# Altium schematic sheet AC-DC.SchDoc
size 420 x 297 mm; Address1: Address1; Address2: Address2; Address3: Address3; Address4: Address4; DocumentNumber: АБВГ.123456.001 Э3; SheetNumber: 2; Scale: 1:1; DocumentType: Схема электрическая принципиальная; FirstReferrence: АБВГ.123456.001
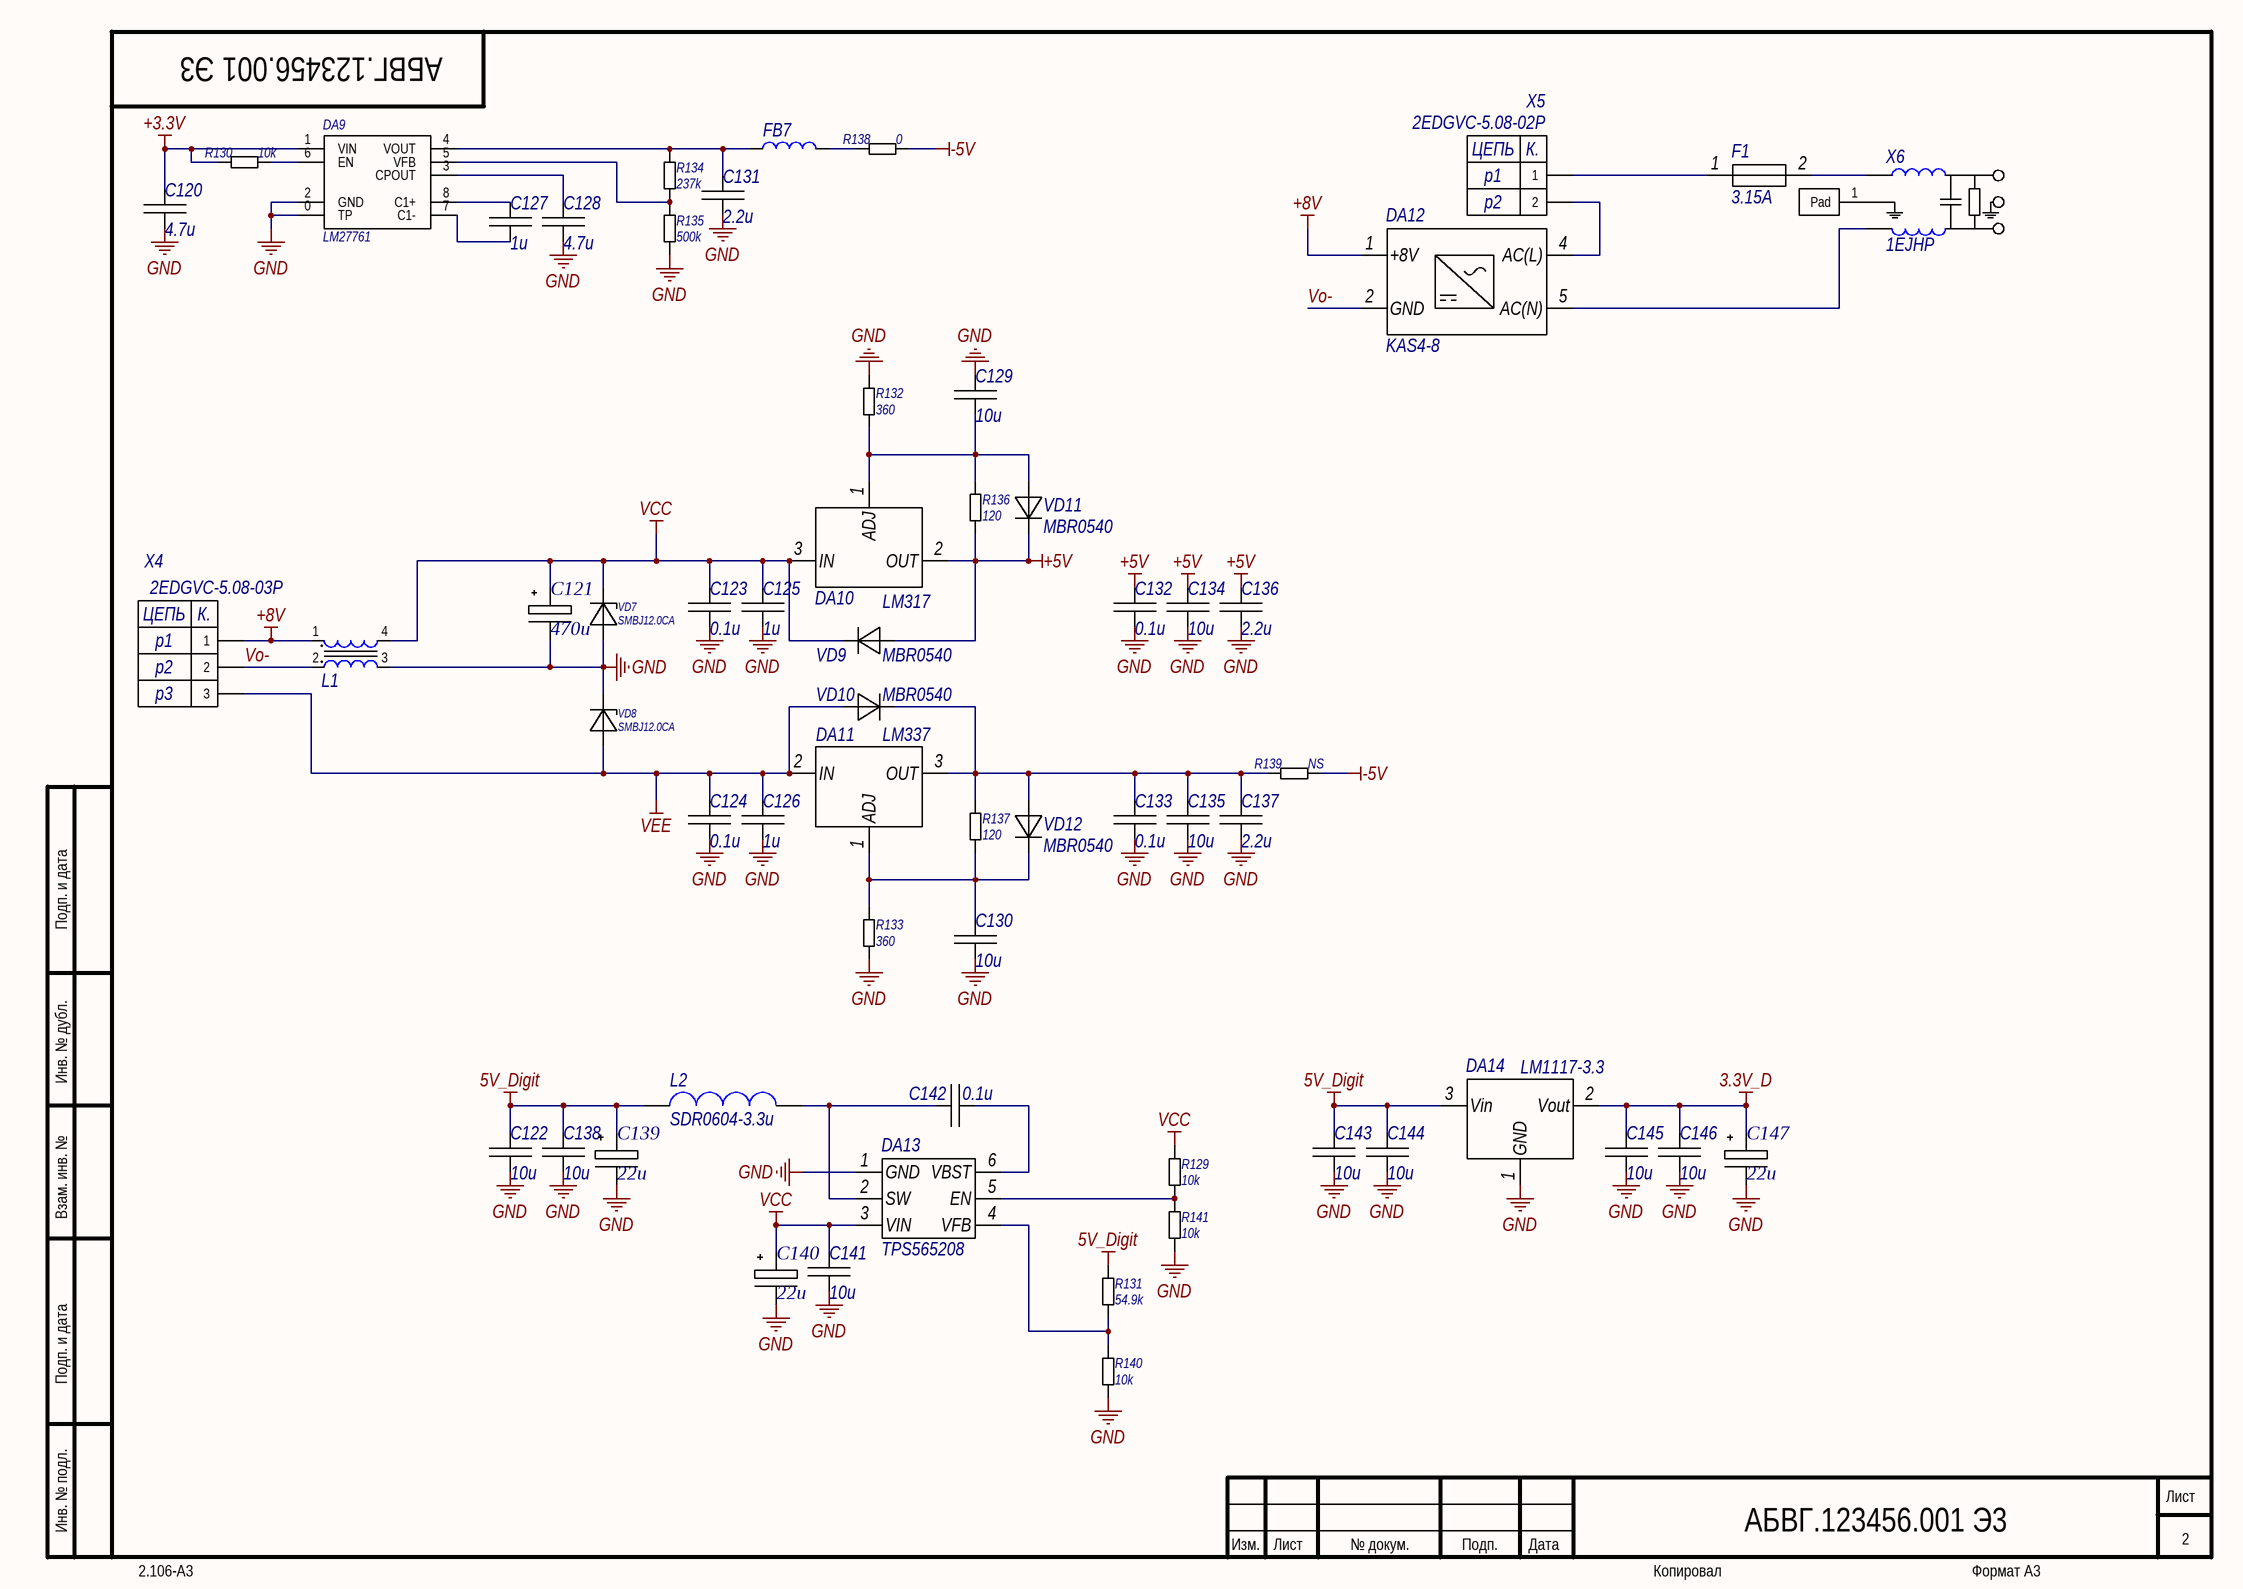
[diagram p0: AC-DC.SchDoc]

## Parts
C120  4.7u  [C0805]
C121  470u  [C1717]
C122  10u  [C1206]
C123  0.1u  [C1206]
C124  0.1u  [C1206]
C125  1u  [C1206]
C126  1u  [C1206]
C127  1u  [C0805]
C128  4.7u  [C0805]
C129  10u  [C1206]
C130  10u  [C1206]
C131  2.2u  [C0805]
C132  0.1u  [C1206]
C133  0.1u  [C1206]
C134  10u  [C1206]
C135  10u  [C1206]
C136  2.2u  [C1206]
C137  2.2u  [C1206]
C138  10u  [C1206]
C139  22u  [C0605]
C140  22u  [C0605]
C141  10u  [C1206]
C142  0.1u  [C1206]
C143  10u  [C1206]
C144  10u  [C1206]
C145  10u  [C1206]
C146  10u  [C1206]
C147  22u  [C0605]
DA9  LM27761  [WSON-8]
DA10  LM317  [D2PAK]
DA11  LM337  [D2PAK]
DA12  KAS4-8  [KAS4-8]
DA13  TPS565208  [SOT23-6]
DA14  LM1117-3.3  [DPAK - LM1117]
F1  3.15A  [5x20mm]
FB7  MH1608-601Y  [L0603]  (value not drawn)
L1  744221  [WE-SL2 SMD]  (value not drawn)
L2  SDR0604-3.3u  [SDR0604]
P1  PAD  [PAD]  (value not drawn)
R129  10k  [CR0805]
R130  10k  [CR0805]
R131  54.9k  [CR0805]
R132  360  [CR1206]
R133  360  [CR1206]
R134  237k  [CR0805]
R135  500k  [CR0805]
R136  120  [CR1206]
R137  120  [CR1206]
R138  0  [CR0805]
R139  NS  [CR0805]
R140  10k  [CR0805]
R141  10k  [CR0805]
VD7  SMBJ12.0CA  [DO-214AA]
VD8  SMBJ12.0CA  [DO-214AA]
VD9  MBR0540  [SOD123]
VD10  MBR0540  [SOD123]
VD11  MBR0540  [SOD123]
VD12  MBR0540  [SOD123]
X4  2EDGVC-5.08-03P  [2EDGVC-5.08-03P]
X5  2EDGVC-5.08-02P  [2EDGVC-5.08-02P]
X6  1EJHP  [1EJHP]

## Nets
3.3V_D: C145.1 C146.1 C147.1 DA14.2(Vout)
5V_Digit: C122.1 C138.1 C139.1 C143.1 C144.1 DA14.3(Vin) L2.1 R131.1
+3.3V: C120.1 DA9.1(VIN) R130.2
+5V: C132.1 C134.1 C136.1 DA10.2(OUT) R136.1 VD9.2 VD11.1
+8V: DA12.1(+8V) L1.1 X4.1
-5V: R138.1 R139.1
GND: C120.2 C121.2 C122.2 C123.2 C124.2 C125.2 C126.2 C128.2 C129.1 C130.2 C131.2 C132.2 C133.2 C134.2 C135.2 C136.2 C137.2 C138.2 C139.2 C140.2 C141.2 C143.2 C144.2 C145.2 C146.2 C147.2 DA9.0(TP) DA9.2(GND) DA13.1(GND) DA14.1(GND) L1.3 R132.2 R133.1 R135.1 R140.2 R141.2 VD7.2 VD8.1
VCC: C121.1 C123.1 C125.1 C140.1 C141.1 DA10.3(IN) DA13.3(VIN) L1.4 R129.1 VD7.1 VD9.1
VEE: C124.1 C126.1 DA11.2(IN) VD8.2 VD10.2 X4.3
Vo-: DA12.2(GND) L1.2 X4.2
NetC127_1: C127.1 DA9.8(C1+)
NetC127_2: C127.2 DA9.7(C1-)
NetC128_1: C128.1 DA9.3(CPOUT)
NetC129_2: C129.2 DA10.1(ADJ) R132.1 R136.2 VD11.2
NetC130_1: C130.1 DA11.1(ADJ) R133.2 R137.1 VD12.1
NetC131_1: C131.1 DA9.4(VOUT) FB7.1 R134.2
NetC133_1: C133.1 C135.1 C137.1 DA11.3(OUT) R137.2 R139.2 VD10.1 VD12.2
NetC142_1: C142.1 DA13.2(SW) L2.2
NetC142_2: C142.2 DA13.6(VBST)
NetDA9_5: DA9.5(VFB) R134.1 R135.2
NetDA9_6: DA9.6(EN) R130.1
NetDA12_4: DA12.4(AC(L)) X5.2
NetDA12_5: DA12.5(AC(N)) X6.2(AC(N))
NetDA13_4: DA13.4(VFB) R131.2 R140.1
NetDA13_5: DA13.5(EN) R129.2 R141.1
NetF1_1: F1.1(IN) X5.1
NetF1_2: F1.2(OUT) X6.1(AC(L))
NetFB7_2: FB7.2 R138.2
NetP1_1: P1.1(Pad) X6.3(G)

Not connected (* = marked no-connect by the designer): DA12 3(NC) 6(NC)

## Notes on the sheet
- Подп. и дата
- Инв. № дубл.
- Взам. инв. №
- Инв. № подл.
- Изм.
- Лист
- № докум.
- Подп.
- Дата
- 2.106-A3
- Копировал
- Формат А3
- (in symbol 2EDGVC-5.08-02P) ЦЕПЬ; К.; p1; p2
- (in symbol 2EDGVC-5.08-03P) ЦЕПЬ; К.; p1; p2; p3

## Library data of the parts
C120 C122-C138 C141-C146 = Capacitor Ceramic SMD
C121 C139 C140 C147 = Capacitor Electrolytic
DA14 = LM1117
F1 = FUSE_HOLDER
FB7 = Ferrite Bead
L1 = CommonModeChoke
L2 = SDR0604
R129-R141 = Resistor SMD
VD7 VD8 = SMBJ5.0CA
VD9-VD12 = Diode